# EasyEDA Pro project ProPrj_JS203-39-FIBER-3_2024-11-07.epro, schematic Schematic1

## Sheets
1 P1: Board Name: Board1; Create Date: 2024-11-05; Page Name: P1; Project Name: JS203-39-FIBER-3; Schematic Name: Schematic1; Update Date: 2024-11-05; Company: JOSN; Drawn: KevinLiao; Page Size: A4; Version: V0.1
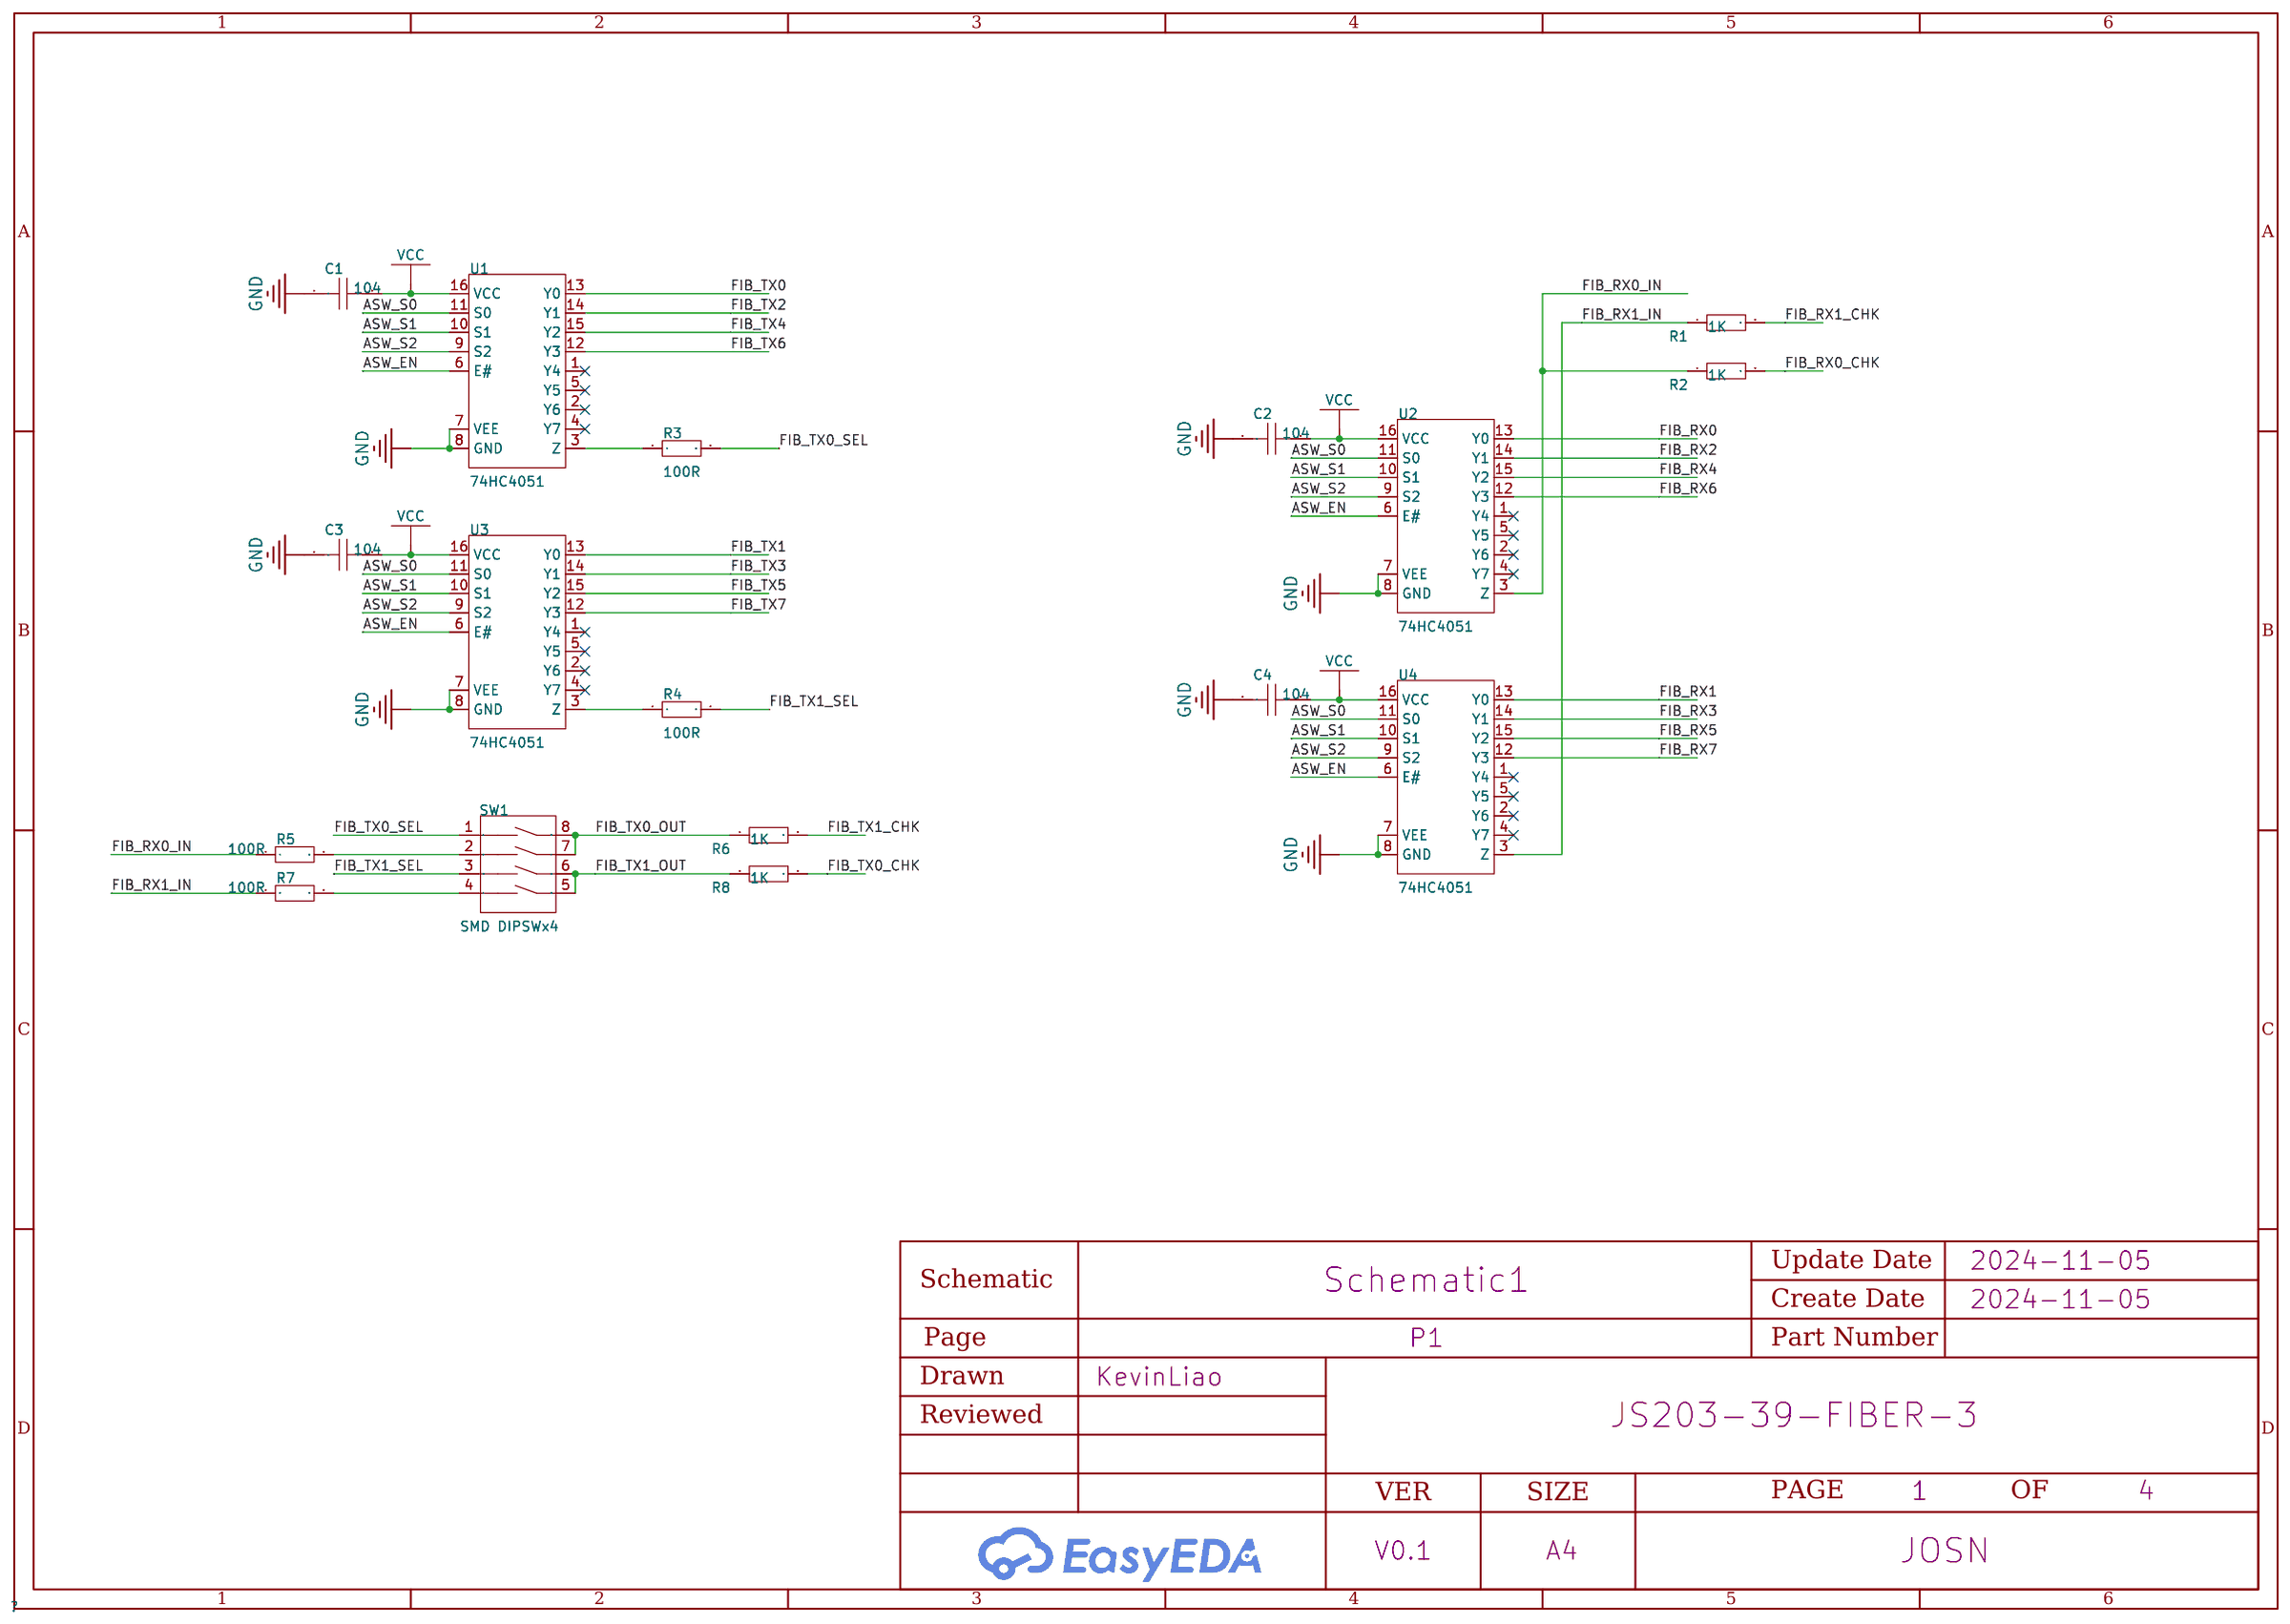
[diagram p0: P1]
2 P2: Page Name: P2
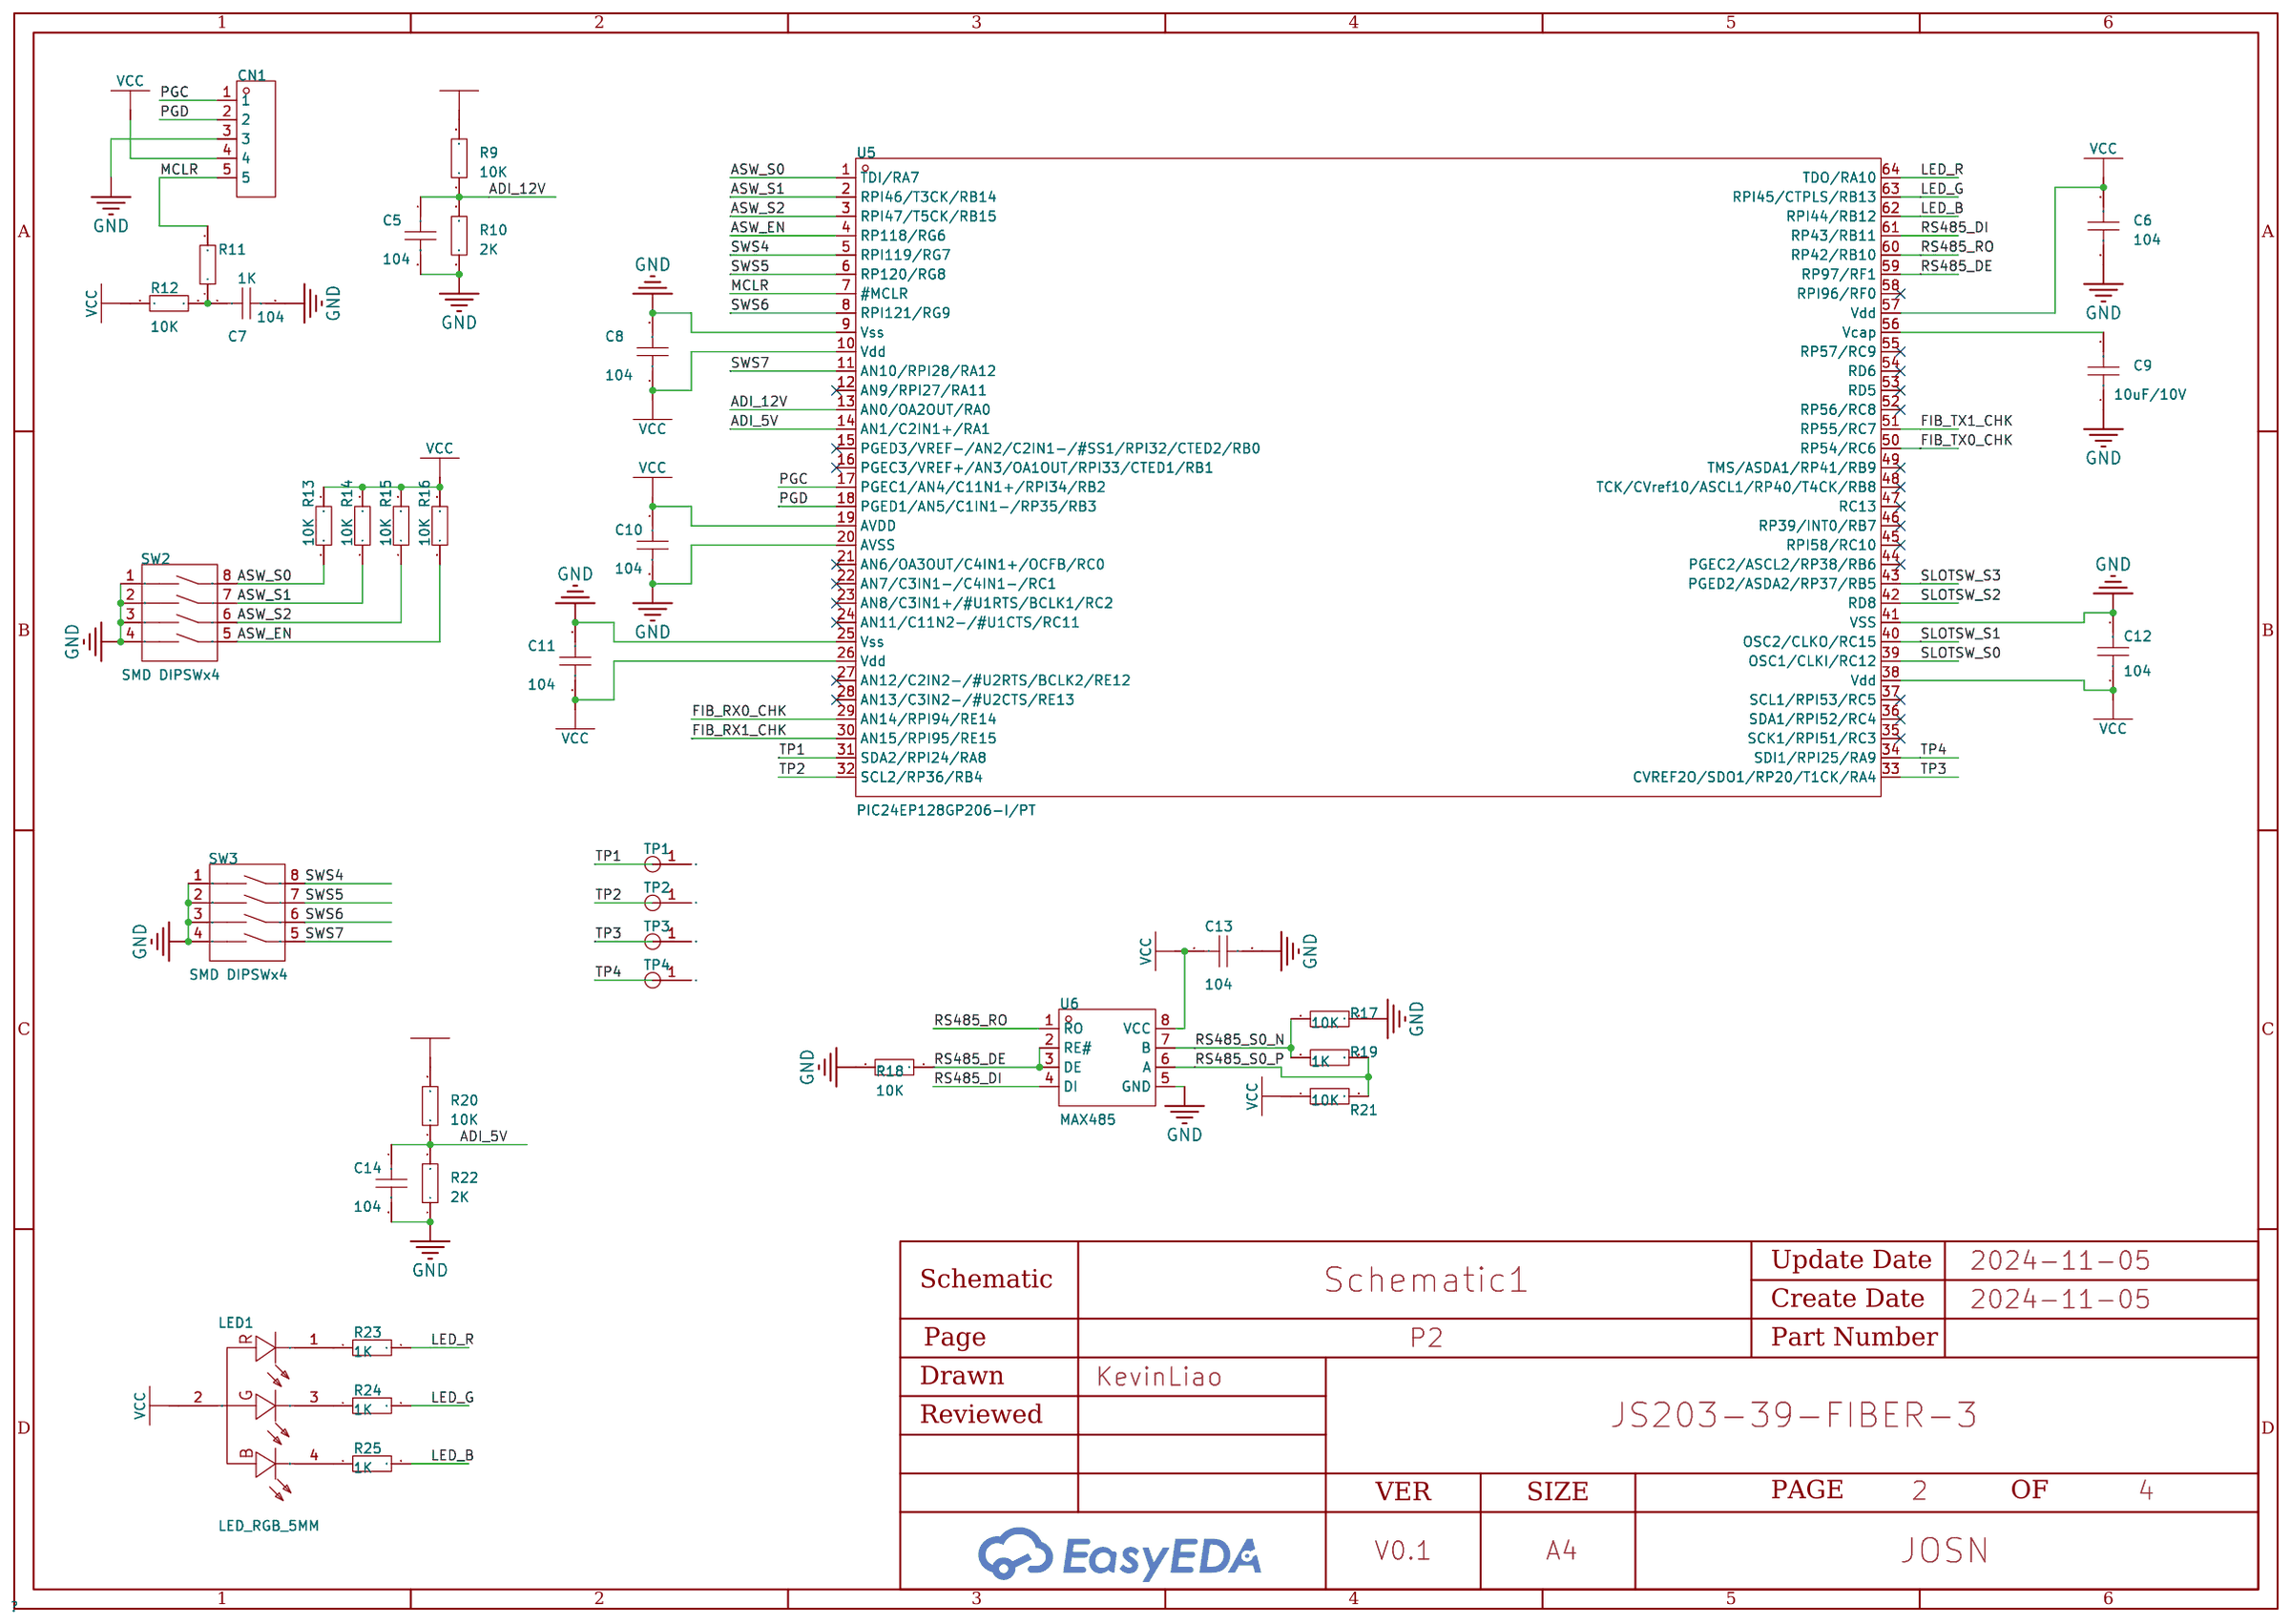
[diagram p1: P2]
3 P3: Page Name: P3; Page Size: A3
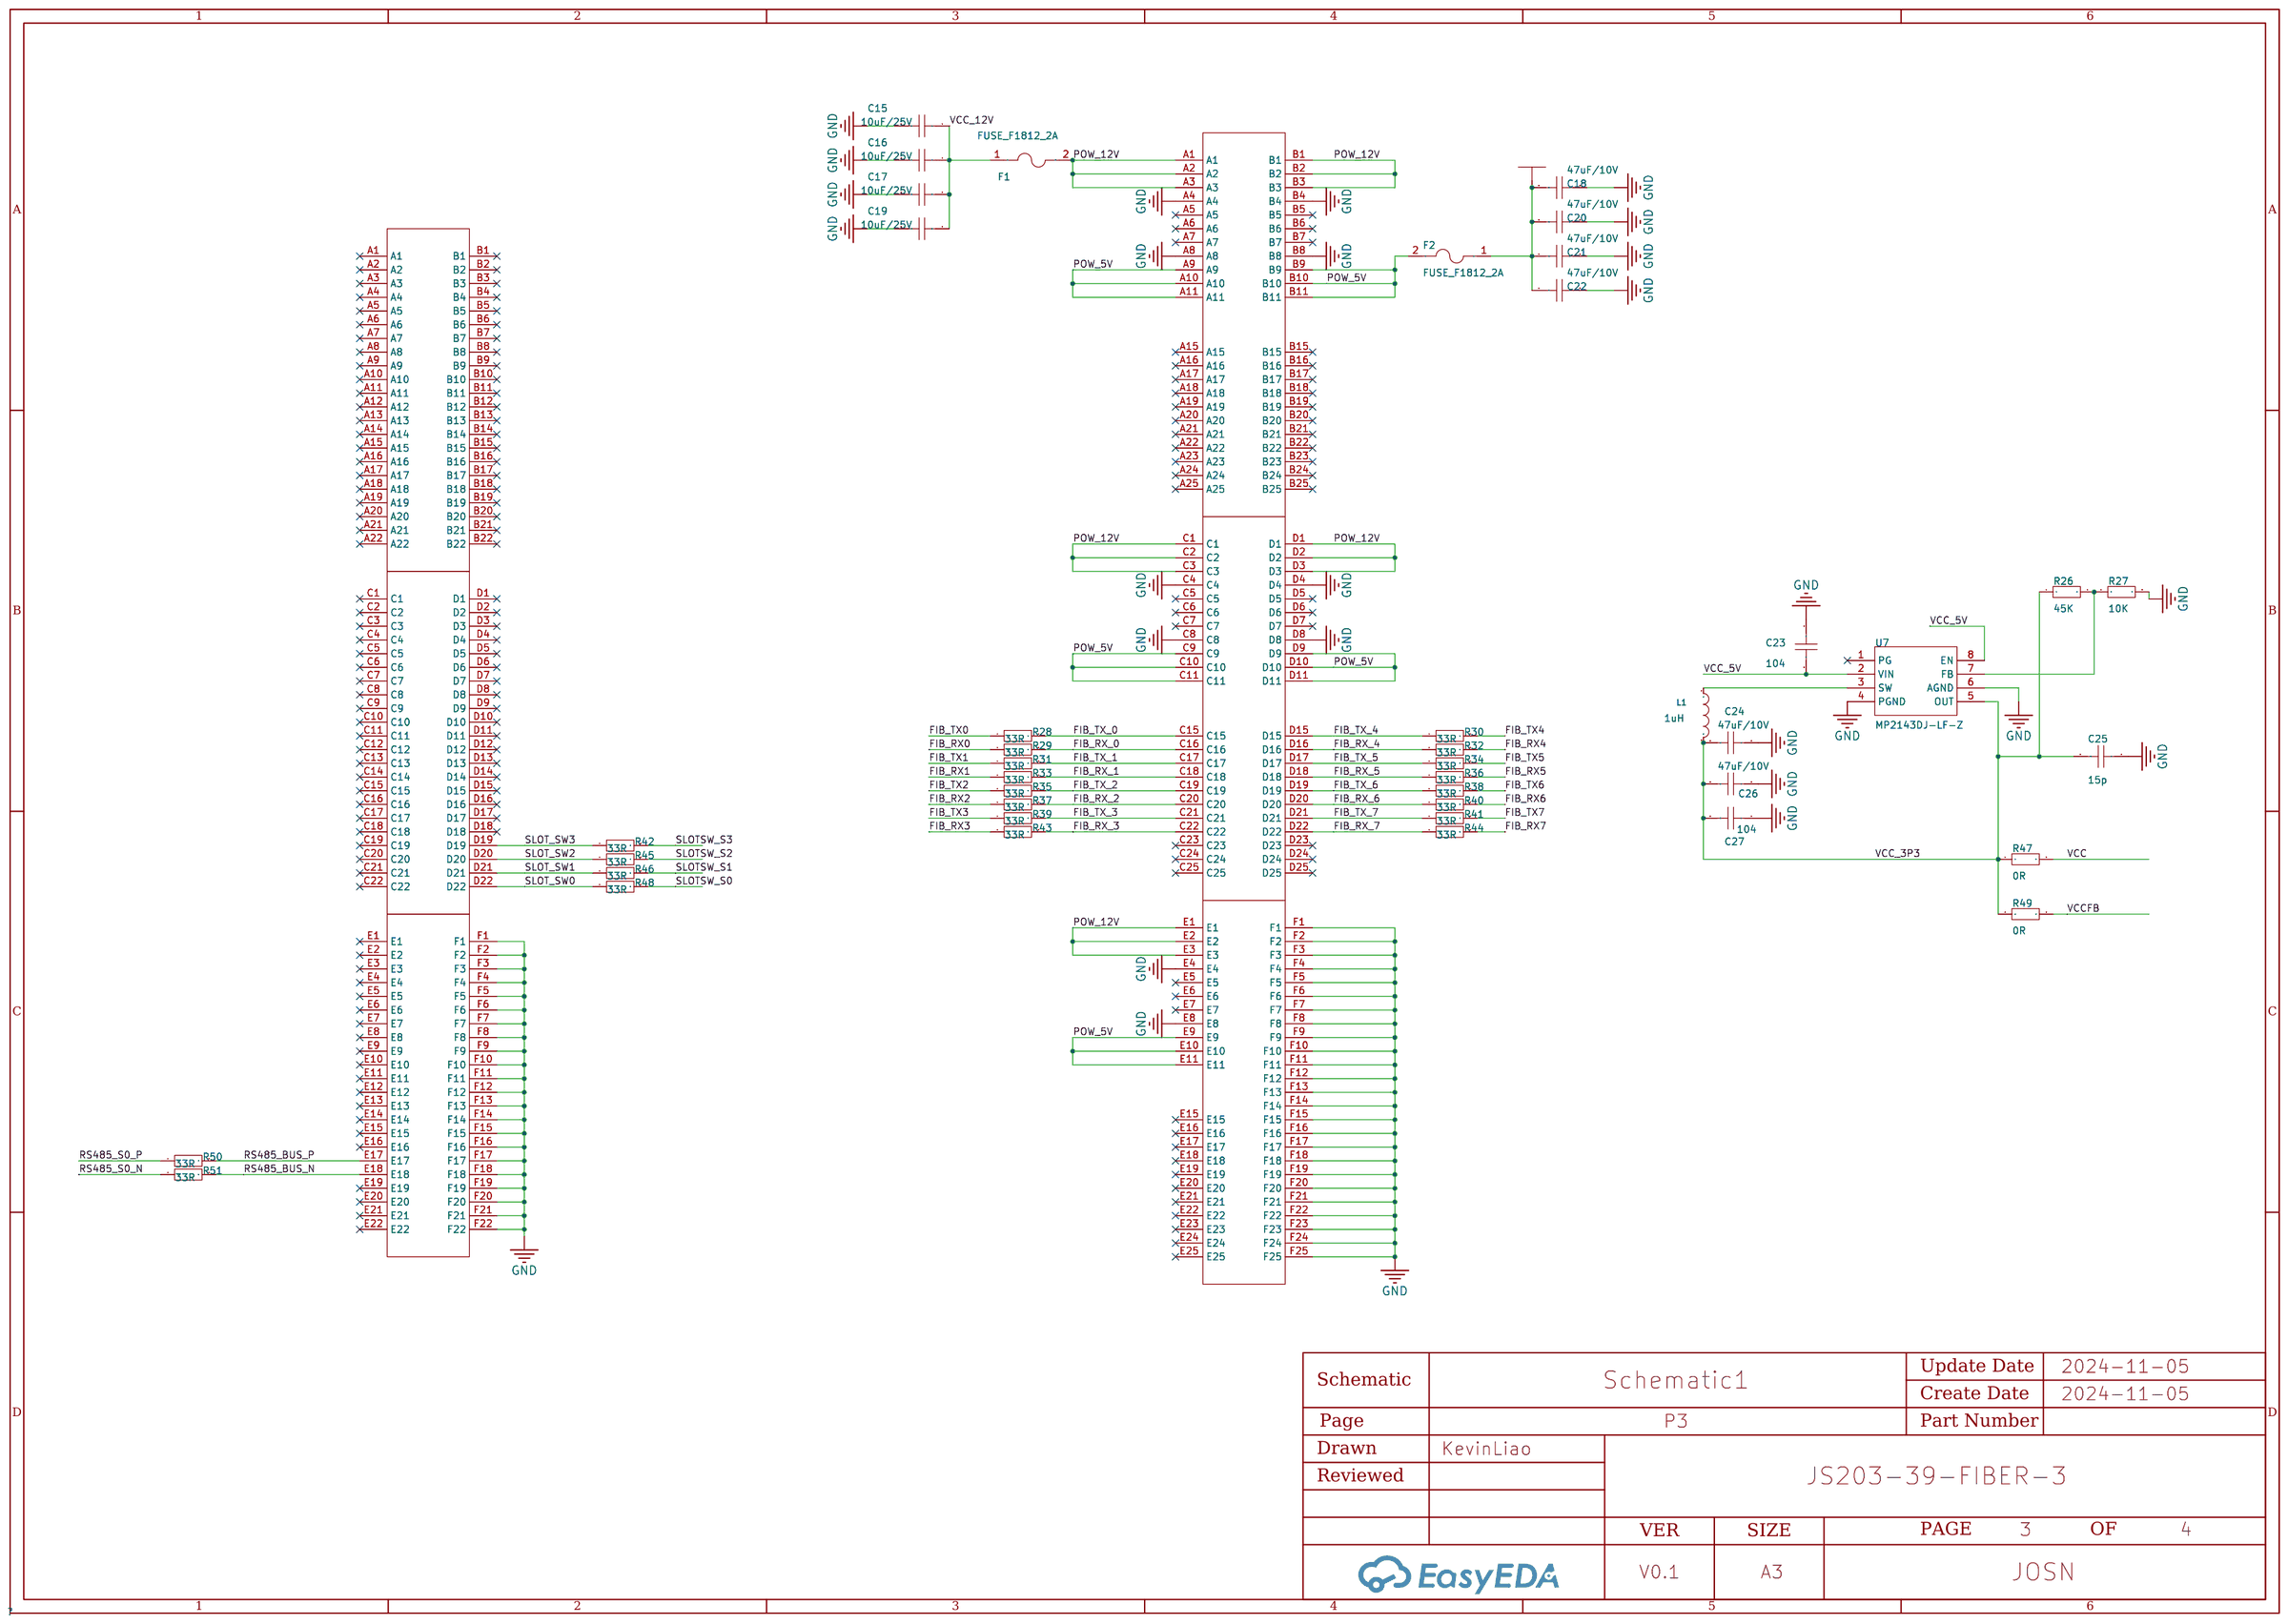
[diagram p2: P3]
4 P4: Page Name: P4; Company: EasyEDA.com; Drawn: EasyEDA; Part Number: JLCPCB-002; Reviewed: EasyEDA
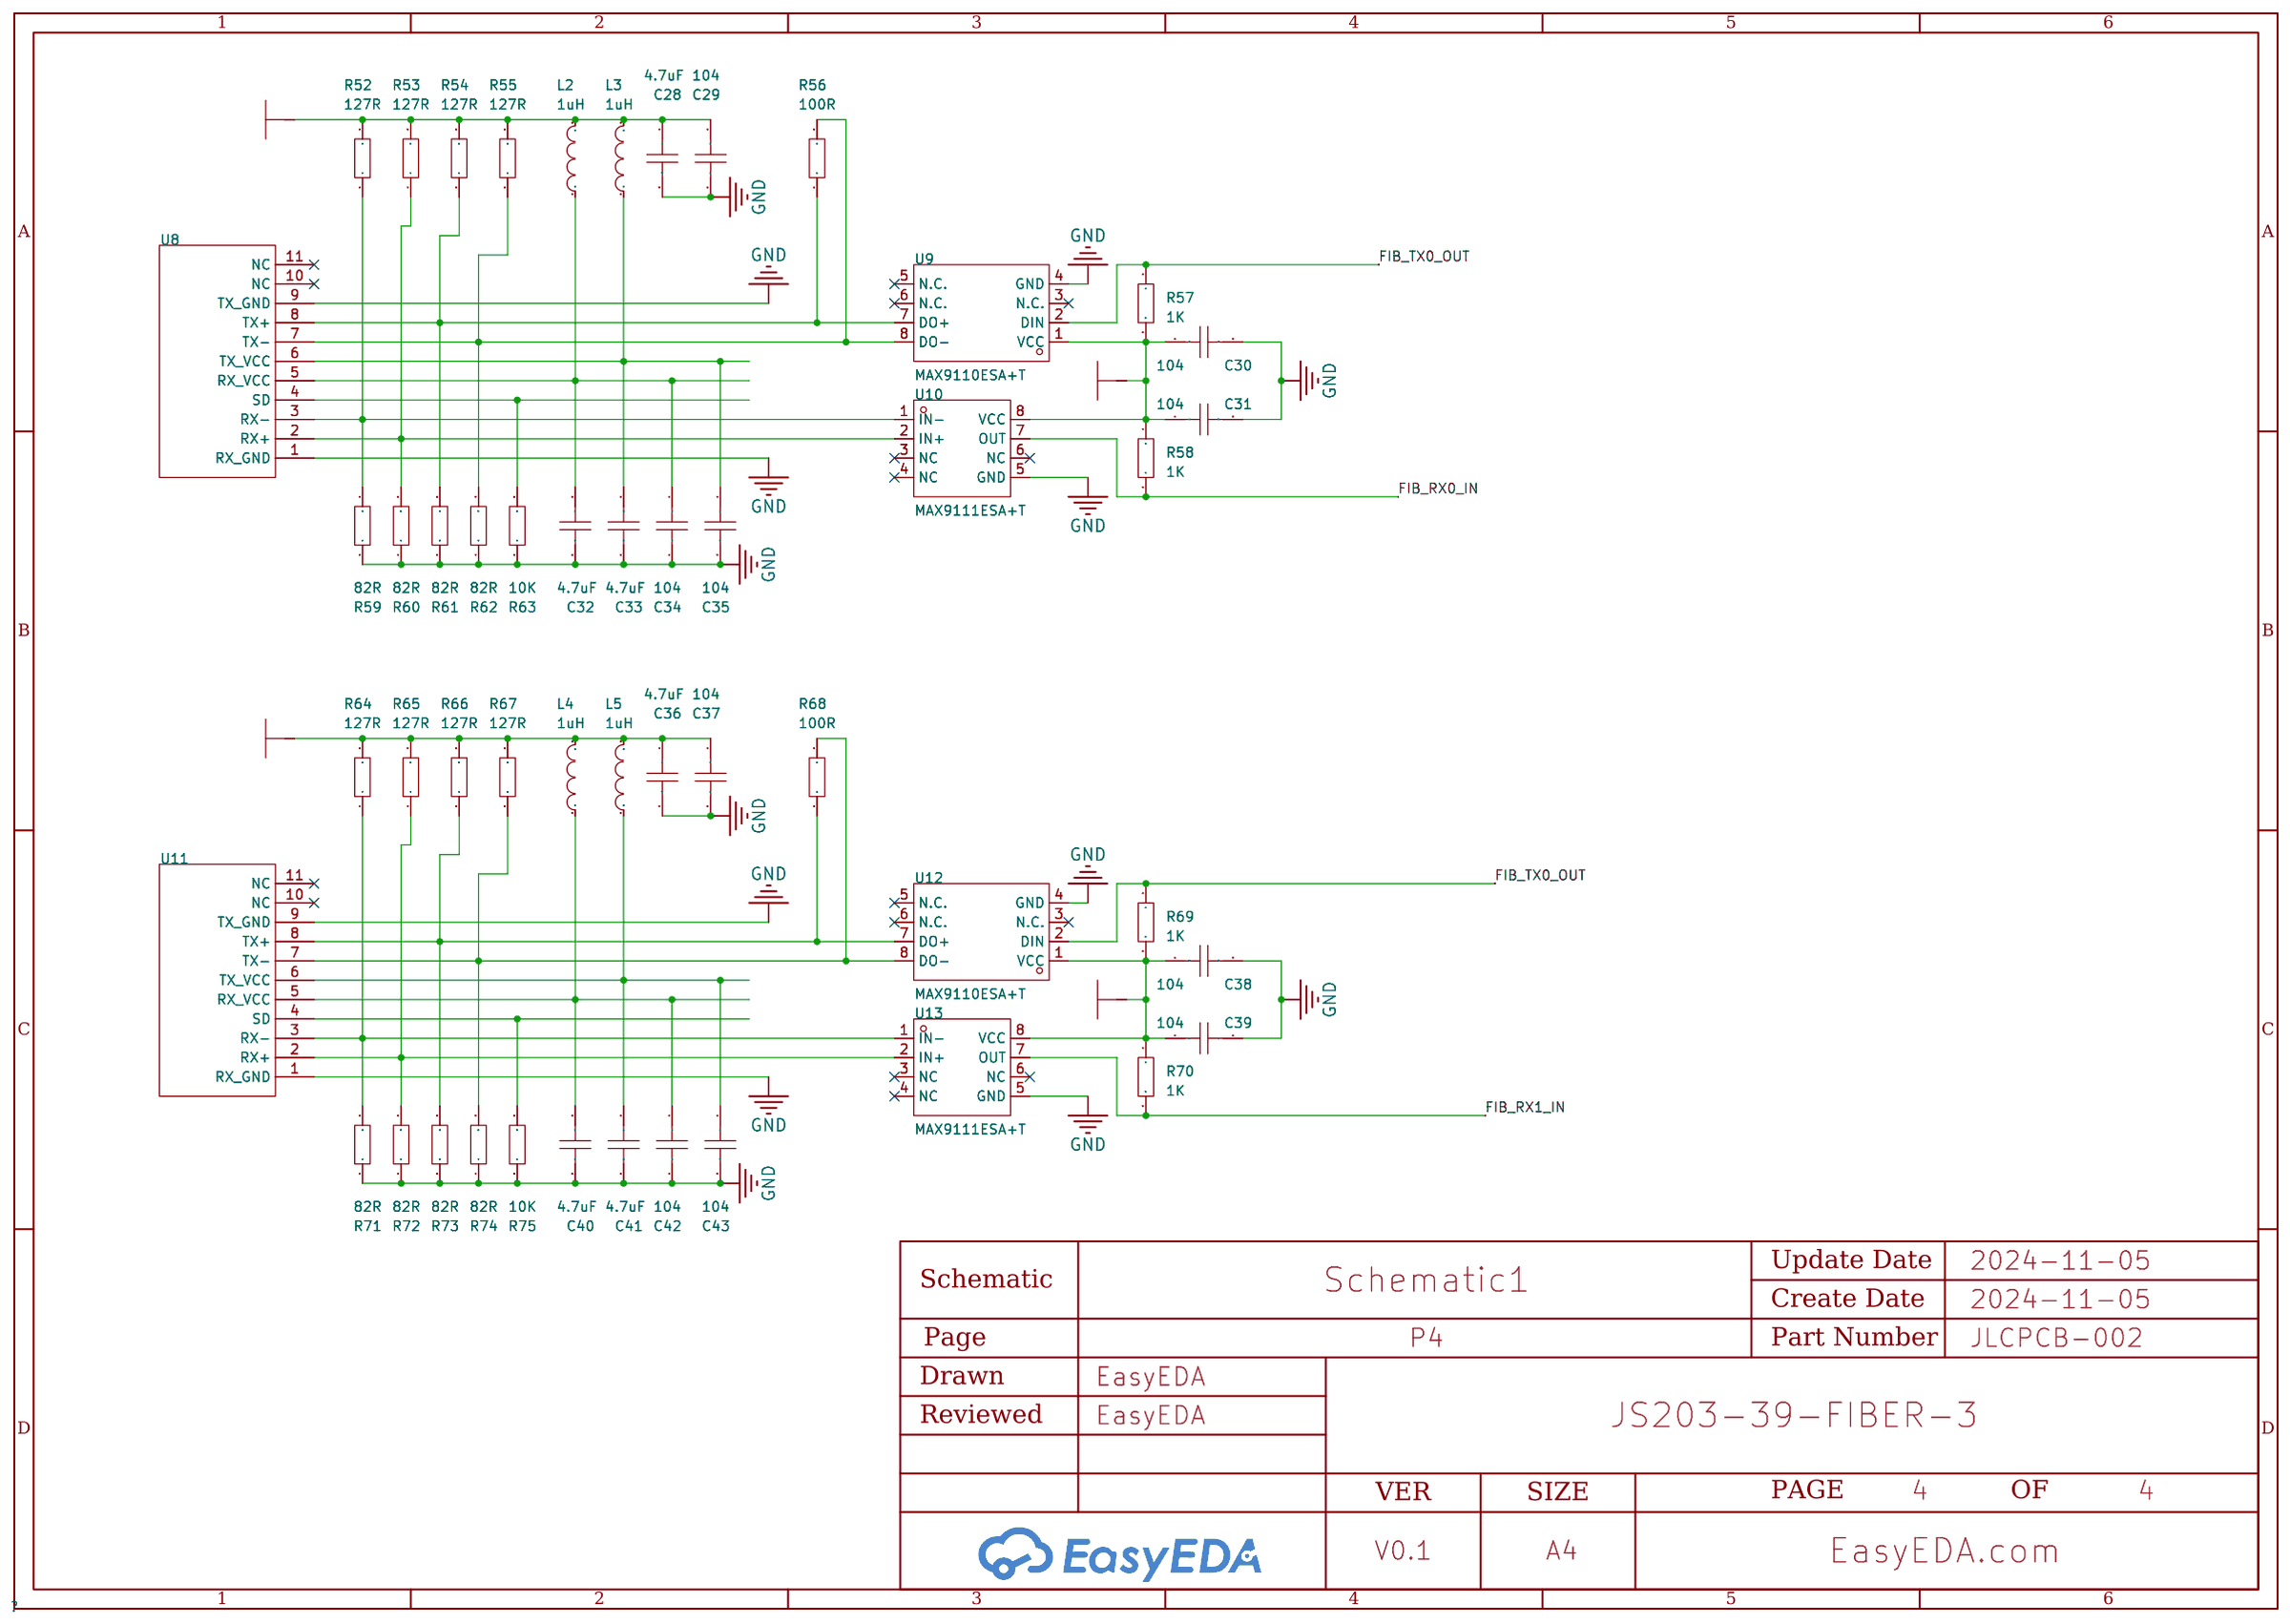
[diagram p3: P4]

## Parts
sheet P1
C1  104  [C0402]
C2  104  [C0402]
C3  104  [C0402]
C4  104  [C0402]
R1  1K  [R0402]
R2  1K  [R0402]
R3  100R  [R0402]
R4  100R  [R0402]
R5  100R  [R0402]
R6  1K  [R0402]
R7  100R  [R0402]
R8  1K  [R0402]
SW1  SMD DIPSWx4  [SW-SMD_8P-L6.7-W5.4-P1.27-LS8.4]
U1  74HC4051  [TSSOP-16_L5.0-W4.4-P0.65-LS6.4-BL-1]
U2  74HC4051  [TSSOP-16_L5.0-W4.4-P0.65-LS6.4-BL-1]
U3  74HC4051  [TSSOP-16_L5.0-W4.4-P0.65-LS6.4-BL-1]
U4  74HC4051  [TSSOP-16_L5.0-W4.4-P0.65-LS6.4-BL-1]
sheet P2
C5  104  [C0402]
C6  104  [C0402]
C7  104  [C0402]
C8  104  [C0402]
C9  10uF/10V  [C0805]
C10  104  [C0402]
C11  104  [C0402]
C12  104  [C0402]
C13  104  [C0402]
C14  104  [C0402]
CN1  5PIN-2.0MM-90  [CONN-TH_5P-P2.00-PH5A]
LED1  LED_RGB_5MM  [LED-TH_4P-BD5.8-P1.30]
R9  10K  [R0402]
R10  2K  [R0402]
R11  1K  [R0402]
R12  10K  [R0402]
R13  10K  [R0402]
R14  10K  [R0402]
R15  10K  [R0402]
R16  10K  [R0402]
R17  10K  [R0402]
R18  10K  [R0402]
R19  1K  [R0402]
R20  10K  [R0402]
R21  10K  [R0402]
R22  2K  [R0402]
R23  1K  [R0402]
R24  1K  [R0402]
R25  1K  [R0402]
SW2  SMD DIPSWx4  [SW-SMD_8P-L6.7-W5.4-P1.27-LS8.4]
SW3  SMD DIPSWx4  [SW-SMD_8P-L6.7-W5.4-P1.27-LS8.4]
TP1  -  [testPoint]
TP2  -  [testPoint]
TP3  -  [testPoint]
TP4  -  [testPoint]
U5  PIC24EP128GP206-I/PT  [TQFP-64_L10.0-W10.0-P0.50-LS12.0-BL]
U6  MAX485  [SOIC-8_L5.0-W4.0-P1.27-LS6.0-BL]
sheet P3
C15  10uF/25V  [C0805]
C16  10uF/25V  [C0805]
C17  10uF/25V  [C0805]
C18  47uF/10V  [C0805]
C19  10uF/25V  [C0805]
C20  47uF/10V  [C0805]
C21  47uF/10V  [C0805]
C22  47uF/10V  [C0805]
C23  104  [C0402]
C24  47uF/10V  [C0805]
C25  15p  [C0402]
C26  47uF/10V  [C0805]
C27  104  [C0402]
CON1  CPCI-CON-B  [cpci-con-b]
CON2  CPCI-CON-A  [cpci-con-a]
F1  FUSE_F1812_2A  [F1812]
F2  FUSE_F1812_2A  [F1812]
L1  1uH  [IND-SMD_L4.0-W4.0-A]
R26  45K  [R0402]
R27  10K  [R0402]
R28  33R  [R0402]
R29  33R  [R0402]
R30  33R  [R0402]
R31  33R  [R0402]
R32  33R  [R0402]
R33  33R  [R0402]
R34  33R  [R0402]
R35  33R  [R0402]
R36  33R  [R0402]
R37  33R  [R0402]
R38  33R  [R0402]
R39  33R  [R0402]
R40  33R  [R0402]
R41  33R  [R0402]
R42  33R  [R0402]
R43  33R  [R0402]
R44  33R  [R0402]
R45  33R  [R0402]
R46  33R  [R0402]
R47  0R  [R1210]
R48  33R  [R0402]
R49  0R  [R1210]
R50  33R  [R0402]
R51  33R  [R0402]
U7  MP2143DJ-LF-Z  [TSOT-23-8_L2.9-W1.6-P0.65-LS2.8-BR]
sheet P4
C28  4.7uF  [C0805]
C29  104  [C0402]
C30  104  [C0402]
C31  104  [C0402]
C32  4.7uF  [C0805]
C33  4.7uF  [C0805]
C34  104  [C0402]
C35  104  [C0402]
C36  4.7uF  [C0805]
C37  104  [C0402]
C38  104  [C0402]
C39  104  [C0402]
C40  4.7uF  [C0805]
C41  4.7uF  [C0805]
C42  104  [C0402]
C43  104  [C0402]
L2  1uH  [L0805]
L3  1uH  [L0805]
L4  1uH  [L0805]
L5  1uH  [L0805]
R52  127R  [R0402]
R53  127R  [R0402]
R54  127R  [R0402]
R55  127R  [R0402]
R56  100R  [R0402]
R57  1K  [R0402]
R58  1K  [R0402]
R59  82R  [R0402]
R60  82R  [R0402]
R61  82R  [R0402]
R62  82R  [R0402]
R63  10K  [R0402]
R64  127R  [R0402]
R65  127R  [R0402]
R66  127R  [R0402]
R67  127R  [R0402]
R68  100R  [R0402]
R69  1K  [R0402]
R70  1K  [R0402]
R71  82R  [R0402]
R72  82R  [R0402]
R73  82R  [R0402]
R74  82R  [R0402]
R75  10K  [R0402]
U8  -  [AFBR-5803TZ]
U9  MAX9110ESA+T  [SOIC-8_L4.9-W3.9-P1.27-LS6.0-BL]
U10  MAX9111ESA+T  [SOIC-8_L4.9-W3.9-P1.27-LS6.0-BL]
U11  -  [AFBR-5803TZ]
U12  MAX9110ESA+T  [SOIC-8_L4.9-W3.9-P1.27-LS6.0-BL]
U13  MAX9111ESA+T  [SOIC-8_L4.9-W3.9-P1.27-LS6.0-BL]

## Library data of the parts
C1-C8 C10-C14 C23 C25 C27 C29-C31 C34 C35 C37-C39 C42 C43 = CAP_0402: Supplier Part: C1525; Supplier Footprint: 0402
R1-R46 R48 R50-R75 = Res_0402: Supplier Footprint: 0402
SW1-SW3 = DSHP04TSGER: Supplier Part: C9900017355; JLCPCB Part Class: Extended Part; Supplier: LCSC
U1-U4 = MM74HC4051MTCX: Number of Channels:1 Supply Voltage:2V~6V Supply Voltage:2V~6V Turn-on time:41ns On-State Resistance (Max):100Ω Turn-off time:32ns; Supplier Part: C3658060; Manufacturer: onsemi(安森美); Supplier Footprint: TSSOP-16; JLCPCB Part Class: 扩展库; Datasheet: https://atta.szlcsc.com/upload/public/pdf/source/20230915/824FCEC5876B234B30D1A8426A82F47F.pdf; Supplier: LCSC; Number of Channels: 1; Supply Voltage: 2V~6V; Turn-on time: 41ns; On-State Resistance (Max): 100Ω; Turn-off time: 32ns
C9 C15-C22 C24 C26 C28 C32 C33 C36 C40 C41 = CAP_0805: Supplier Footprint: 0805
CN1 = 5PIN-2.0MM-90: Supplier Part: C9900021156; Supplier Footprint: CONN-TH-5P; JLCPCB Part Class: Extended Part; Datasheet: https://atta.szlcsc.comnull; Supplier: LCSC
LED1 = 三色灯2: Supplier Part: C9900021929; Supplier Footprint: LED-TH-4P; JLCPCB Part Class: Extended Part; Supplier: LCSC
TP1-TP4 = testPoint
U5 = PIC24EP128GP206-I/PT: CPU Core:PIC Program Storage Size:128KB GPIO Ports Number:53 Operating Voltage Range:3V~3.6V Operating Voltage Range:3V~3.6V CPU Maximum Speed:280MHz Program Memory Type:FLASH Operating Temperature Range:-40℃~+85℃ Operating Temperature Range:-40℃~+85℃ ADC; Supplier Part: C634687; Manufacturer: MICROCHIP(美国微芯); Supplier Footprint: TQFP-64(10x10); JLCPCB Part Class: 扩展库; Datasheet: https://atta.szlcsc.com/upload/public/pdf/source/20211010/C2832038_8BF8787F22686B658698B1EF3F45BF2F.pdf; Supplier: LCSC; CPU Core: PIC; Program Storage Size: 128KB; GPIO Ports Number: 53; Operating Voltage Range: 3V~3.6V; CPU Maximum Speed: 280MHz; Program Memory Type: FLASH; Operating Temperature Range: -40℃~+85℃; ADC (Bit): 10bit；12bit; Peripheral/Function: PWM；PWM; Watchdog: 有; Infrared Data Association: 有; Low-Voltage Detect: 有; Direct Memory Access: 有; Internal Oscillator: 有
U6 = MAX485ESA-MS: Types:transceiver Supply Voltage:4.75V~5.25V Supply Voltage:4.75V~5.25V Data Rate:2.5Mbps Data Rate:2.5Mbps Driver/receiver:1/1 Node Number:32 ESD Protect:±15kV ESD Protect:±15kV Whether the isolation:- Operating Temperature:-40℃~+85℃ Operating Temperatur; Supplier Part: C7434432; Manufacturer: MSKSEMI(美森科); Supplier Footprint: SOP-8; Datasheet: https://atta.szlcsc.com/upload/public/pdf/source/20230628/9E874313D8358D77451CB60EFEDE67C0.pdf; Supplier: LCSC; Types: transceiver; Supply Voltage: 4.75V~5.25V; Data Rate: 2.5Mbps; Driver/receiver: 1/1; Node Number: 32; ESD Protect: ±15kV; Operating Temperature: -40℃~+85℃
CON1 = pci-con-b
CON2 = cpci-con-a
F1 F2 = FUSE_F1812_FUSE: Supplier Part: C9900007509; JLCPCB Part Class: Extended Part; Datasheet: https://atta.szlcsc.comnull; Supplier: LCSC
L1 = XFL4020-152MEC: Inductance: Tolerance:±20% Tolerance:±20% Rated Current:- Saturation Current (Isat):- DC Resistance (DCR):- Type:- Ratings:-; LCSC Part Name: 1.5uH ±20%; Supplier Part: C3033018; Manufacturer: Coilcraft(线艺); Supplier Footprint: SMD,4x4mm; JLCPCB Part Class: Extended Part; Datasheet: https://atta.szlcsc.com/upload/public/pdf/source/20220606/2F3F6B3731D30DFC0E7308BCF15AD72A.pdf; Supplier: LCSC; Tolerance: ±20%
R47 R49 = Res_1210: Supplier Footprint: 1210
U7 = MP2143DJ-LF-Z: Function:Step-down type Output Type:Adjustable Input Voltage:2.5V~5.5V Input Voltage:2.5V~5.5V Output Voltage:0.6V~5V Output Voltage:0.6V~5V Output Current (Max):3A Switching Frequency:1.2MHz Operating Temperature:-40℃~+125℃@(TJ) Operating Temperature:-40; Supplier Part: C43427; Supplier Footprint: TSOT-23-8; JLCPCB Part Class: 扩展库; Supplier: LCSC; Function: Step-down type; Output Type: Adjustable; Input Voltage: 2.5V~5.5V; Output Voltage: 0.6V~5V; Output Current (Max): 3A; Switching Frequency: 1.2MHz; Operating Temperature: -40℃~+125℃@(TJ); Synchronous Rectification: Yes; Number of Outputs: 1; Topology: Step-down; Switch tube (built-in/external): 内置
L2-L5 = L_0805
U8 U11 = AFBR-5803TZ
U9 U12 = MAX9110ESA+T: Type: Protocol: Numberof Drivers:1 Numberof Receivers:0 Supply Voltage:3.3V Supply Voltage:3.3V Data Rate:; Supplier Part: C3235036; Manufacturer: ADI(亚德诺)/MAXIM(美信); Supplier Footprint: SOIC-8; JLCPCB Part Class: 扩展库; Datasheet: https://atta.szlcsc.com/upload/public/pdf/source/20221101/9681F230F46C99E53DA27F614A9C7A00.pdf; Supplier: LCSC; Numberof Drivers: 1; Numberof Receivers: 0; Supply Voltage: 3.3V
U10 U13 = MAX9111ESA+T: Type:Receivers Protocol: Numberof Drivers:0 Numberof Receivers:1 Supply Voltage:3V~3.6V Supply Voltage:3V~3.6V Data Rate:; Supplier Part: C2672252; Manufacturer: ADI(亚德诺)/MAXIM(美信); Supplier Footprint: SOIC-8; JLCPCB Part Class: 扩展库; Datasheet: https://atta.szlcsc.com/upload/public/pdf/source/20210603/E06AC82415230B9EDCD0D7C660C507AE.pdf; Supplier: LCSC; Type: Receivers; Numberof Drivers: 0; Numberof Receivers: 1; Supply Voltage: 3V~3.6V

## Nets
GND: C1.1 C2.1 C3.1 C4.1 C5.2 C6.2 C7.2 C8.2 C9.1 C10.2 C11.2 C12.2 C13.2 C14.2 C15.2 C16.2 C17.2 C18.2 C19.2 C20.2 C21.2 C22.2 C23.1 C24.1 C25.1 C26.1 C27.1 C28.2 C29.2 C30.2 C31.2 C32.2 C33.2 C34.2 C35.2 C36.2 C37.2 C38.2 C39.2 C40.2 C41.2 C42.2 C43.2 CN1.3 CON1.A4 CON1.A8 CON1.B4 CON1.B8 CON1.C4 CON1.C8 CON1.D4 CON1.D8 CON1.E4 CON1.E8 CON1.F1 CON1.F2 CON1.F3 CON1.F4 CON1.F5 CON1.F6 CON1.F7 CON1.F8 CON1.F9 CON1.F10 CON1.F11 CON1.F12 CON1.F13 CON1.F14 CON1.F15 CON1.F16 CON1.F17 CON1.F18 CON1.F19 CON1.F20 CON1.F21 CON1.F22 CON1.F23 CON1.F24 CON1.F25 CON2.F1 CON2.F2 CON2.F3 CON2.F4 CON2.F5 CON2.F6 CON2.F7 CON2.F8 CON2.F9 CON2.F10 CON2.F11 CON2.F12 CON2.F13 CON2.F14 CON2.F15 CON2.F16 CON2.F17 CON2.F18 CON2.F19 CON2.F20 CON2.F21 CON2.F22 R10.1 R17.2 R18.2 R22.1 R27.2 R59.1 R60.1 R61.1 R62.1 R63.1 R71.1 R72.1 R73.1 R74.1 R75.1 SW2.1 SW2.2 SW2.3 SW2.4 SW3.1 SW3.2 SW3.3 SW3.4 U1.7(VEE) U1.8(GND) U2.7(VEE) U2.8(GND) U3.7(VEE) U3.8(GND) U4.7(VEE) U4.8(GND) U5.9(Vss) U5.20(AVSS) U5.25(Vss) U5.41(VSS) U6.5(GND) U7.4(PGND) U7.6(AGND) U8.1(RX_GND) U8.9(TX_GND) U9.4(GND) U10.5(GND) U11.1(RX_GND) U11.9(TX_GND) U12.4(GND) U13.5(GND)
VCC: C1.2 C2.2 C3.2 C4.2 C6.1 C8.1 C10.1 C11.1 C12.1 C13.1 CN1.4 LED1.2(CA) R12.1 R13.2 R14.2 R15.2 R16.2 R21.1 R47.2 U1.16(VCC) U2.16(VCC) U3.16(VCC) U4.16(VCC) U5.10(Vdd) U5.19(AVDD) U5.26(Vdd) U5.38(Vdd) U5.57(Vdd) U6.8(VCC)
VCC_3P3: C24.2 C25.2 C26.2 C27.2 L1.2 R26.1 R47.1 R49.1 U7.5(OUT)
VCC_5V: C18.1 C20.1 C21.1 C22.1 C23.2 F2.1 R20.2 U7.2(VIN) U7.8(EN)
VCC_12V: C15.1 C16.1 C17.1 C19.1 F1.1 R9.2
VCCFB: C28.1 C29.1 C30.1 C31.1 C36.1 C37.1 C38.1 C39.1 L2.2 L3.2 L4.2 L5.2 R49.2 R52.2 R53.2 R54.2 R55.2 R57.2 R58.1 R64.2 R65.2 R66.2 R67.2 R69.2 R70.1 U9.1(VCC) U10.8(VCC) U12.1(VCC) U13.8(VCC)
ADI_5V: C14.1 R20.1 R22.2 U5.14(AN1/C2IN1+/RA1)
ADI_12V: C5.1 R9.1 R10.2 U5.13(AN0/OA2OUT/RA0)
ASW_EN: R16.1 SW2.5 U1.6(E#) U2.6(E#) U3.6(E#) U4.6(E#) U5.4(RP118/RG6)
ASW_S0: R13.1 SW2.8 U1.11(S0) U2.11(S0) U3.11(S0) U4.11(S0) U5.1(TDI/RA7)
ASW_S1: R14.1 SW2.7 U1.10(S1) U2.10(S1) U3.10(S1) U4.10(S1) U5.2(RPI46/T3CK/RB14)
ASW_S2: R15.1 SW2.6 U1.9(S2) U2.9(S2) U3.9(S2) U4.9(S2) U5.3(RPI47/T5CK/RB15)
FIB_RX0: R29.1 U2.13(Y0)
FIB_RX0_CHK: R2.2 U5.29(AN14/RPI94/RE14)
FIB_RX0_IN: R2.1 R5.1 R58.2 U2.3(Z) U10.7(OUT)
FIB_RX1: R33.1 U4.13(Y0)
FIB_RX1_CHK: R1.2 U5.30(AN15/RPI95/RE15)
FIB_RX1_IN: R1.1 R7.1 R70.2 U4.3(Z) U13.7(OUT)
FIB_RX2: R37.1 U2.14(Y1)
FIB_RX3: R43.1 U4.14(Y1)
FIB_RX4: R32.2 U2.15(Y2)
FIB_RX5: R36.2 U4.15(Y2)
FIB_RX6: R40.2 U2.12(Y3)
FIB_RX7: R44.2 U4.12(Y3)
FIB_RX_0: CON1.C16 R29.2
FIB_RX_1: CON1.C18 R33.2
FIB_RX_2: CON1.C20 R37.2
FIB_RX_3: CON1.C22 R43.2
FIB_RX_4: CON1.D16 R32.1
FIB_RX_5: CON1.D18 R36.1
FIB_RX_6: CON1.D20 R40.1
FIB_RX_7: CON1.D22 R44.1
FIB_TX0: R28.1 U1.13(Y0)
FIB_TX0_CHK: R8.2 U5.50(RP54/RC6)
FIB_TX0_OUT: R6.1 R57.1 R69.1 SW1.7 SW1.8 U9.2(DIN) U12.2(DIN)
FIB_TX0_SEL: R3.2 SW1.1
FIB_TX1: R31.1 U3.13(Y0)
FIB_TX1_CHK: R6.2 U5.51(RP55/RC7)
FIB_TX1_OUT: R8.1 SW1.5 SW1.6
FIB_TX1_SEL: R4.2 SW1.3
FIB_TX2: R35.1 U1.14(Y1)
FIB_TX3: R39.1 U3.14(Y1)
FIB_TX4: R30.2 U1.15(Y2)
FIB_TX5: R34.2 U3.15(Y2)
FIB_TX6: R38.2 U1.12(Y3)
FIB_TX7: R41.2 U3.12(Y3)
FIB_TX_0: CON1.C15 R28.2
FIB_TX_1: CON1.C17 R31.2
FIB_TX_2: CON1.C19 R35.2
FIB_TX_3: CON1.C21 R39.2
FIB_TX_4: CON1.D15 R30.1
FIB_TX_5: CON1.D17 R34.1
FIB_TX_6: CON1.D19 R38.1
FIB_TX_7: CON1.D21 R41.1
LED_B: R25.2 U5.62(RPI44/RB12)
LED_G: R24.2 U5.63(RPI45/CTPLS/RB13)
LED_R: R23.2 U5.64(TDO/RA10)
MCLR: CN1.5 R11.2 U5.7(#MCLR)
PGC: CN1.1 U5.17(PGEC1/AN4/C11N1+/RPI34/RB2)
PGD: CN1.2 U5.18(PGED1/AN5/C1IN1-/RP35/RB3)
POW_5V: CON1.A9 CON1.A10 CON1.A11 CON1.B9 CON1.B10 CON1.B11 CON1.C9 CON1.C10 CON1.C11 CON1.D9 CON1.D10 CON1.D11 CON1.E9 CON1.E10 CON1.E11 F2.2
POW_12V: CON1.A1 CON1.A2 CON1.A3 CON1.B1 CON1.B2 CON1.B3 CON1.C1 CON1.C2 CON1.C3 CON1.D1 CON1.D2 CON1.D3 CON1.E1 CON1.E2 CON1.E3 F1.2
RS485_BUS_N: CON2.E18 R51.2
RS485_BUS_P: CON2.E17 R50.2
RS485_DE: R18.1 U5.59(RP97/RF1) U6.2(RE#) U6.3(DE)
RS485_DI: U5.61(RP43/RB11) U6.4(DI)
RS485_RO: U5.60(RP42/RB10) U6.1(RO)
RS485_S0_N: R17.1 R19.1 R51.1 U6.7(B)
RS485_S0_P: R19.2 R21.2 R50.1 U6.6(A)
SLOT_SW0: CON2.D22 R48.1
SLOT_SW1: CON2.D21 R46.1
SLOT_SW2: CON2.D20 R45.1
SLOT_SW3: CON2.D19 R42.1
SLOTSW_S0: R48.2 U5.39(OSC1/CLKI/RC12)
SLOTSW_S1: R46.2 U5.40(OSC2/CLKO/RC15)
SLOTSW_S2: R45.2 U5.42(RD8)
SLOTSW_S3: R42.2 U5.43(PGED2/ASDA2/RP37/RB5)
SWS4: SW3.8 U5.5(RPI119/RG7)
SWS5: SW3.7 U5.6(RP120/RG8)
SWS6: SW3.6 U5.8(RPI121/RG9)
SWS7: SW3.5 U5.11(AN10/RPI28/RA12)
TP1: TP1.1 U5.31(SDA2/RPI24/RA8)
TP2: TP2.1 U5.32(SCL2/RP36/RB4)
TP3: TP3.1 U5.33(CVREF2O/SDO1/RP20/T1CK/RA4)
TP4: TP4.1 U5.34(SDI1/RPI25/RA9)
$1N8234: R3.1 U1.3(Z)
$1N8273: R4.1 U3.3(Z)
$1N8683: R5.2 SW1.2
$1N8687: R7.2 SW1.4
$2N4157: LED1.1(KR) R23.1
$2N4158: LED1.3(KG) R24.1
$2N4159: LED1.4(KB) R25.1
$2N4826: C9.2 U5.56(Vcap)
$2N7069: C7.1 R11.1 R12.2
$3N8331: L1.1 U7.3(SW)
$3N10229: R26.2 R27.1 U7.7(FB)
$4N1825: R54.1 R56.1 R61.2 U8.8(TX+) U9.7(DO+)
$4N1834: R55.1 R56.2 R62.2 U8.7(TX-) U9.8(DO-)
$4N1844: C33.1 C35.1 L3.1 U8.6(TX_VCC)
$4N1851: C32.1 C34.1 L2.1 U8.5(RX_VCC)
$4N1858: R63.2 U8.4(SD)
$4N1862: R52.1 R59.2 U8.3(RX-) U10.1(IN-)
$4N1867: R53.1 R60.2 U8.2(RX+) U10.2(IN+)
$4N1936: R66.1 R68.1 R73.2 U11.8(TX+) U12.7(DO+)
$4N1945: R67.1 R68.2 R74.2 U11.7(TX-) U12.8(DO-)
$4N1955: C41.1 C43.1 L5.1 U11.6(TX_VCC)
$4N1962: C40.1 C42.1 L4.1 U11.5(RX_VCC)
$4N1969: R75.2 U11.4(SD)
$4N1973: R64.1 R71.2 U11.3(RX-) U13.1(IN-)
$4N1978: R65.1 R72.2 U11.2(RX+) U13.2(IN+)

Not connected (* = marked no-connect by the designer): CON1 A5* A6* A7* A15* A16* A17* A18* A19* A20* A21* A22* A23* A24* A25* B5* B6* B7* B15* B16* B17* B18* B19* B20* B21* B22* B23* B24* B25* C5* C6* C7* C23* C24* C25* D5* D6* D7* D23* D24* D25* E5* E6* E7* E15* E16* E17* E18* E19* E20* E21* E22* E23* E24* E25*; CON2 A1* A2* A3* A4* A5* A6* A7* A8* A9* A10* A11* A12* A13* A14* A15* A16* A17* A18* A19* A20* A21* A22* B1* B2* B3* B4* B5* B6* B7* B8* B9* B10* B11* B12* B13* B14* B15* B16* B17* B18* B19* B20* B21* B22* C1* C2* C3* C4* C5* C6* C7* C8* C9* C10* C11* C12* C13* C14* C15* C16* C17* C18* C19* C20* C21* C22* D1* D2* D3* D4* D5* D6* D7* D8* D9* D10* D11* D12* D13* D14* D15* D16* D17* D18* E1* E2* E3* E4* E5* E6* E7* E8* E9* E10* E11* E12* E13* E14* E15* E16* E19* E20* E21* E22*; U1 1(Y4)* 2(Y6)* 4(Y7)* 5(Y5)*; U2 1(Y4)* 2(Y6)* 4(Y7)* 5(Y5)*; U3 1(Y4)* 2(Y6)* 4(Y7)* 5(Y5)*; U4 1(Y4)* 2(Y6)* 4(Y7)* 5(Y5)*; U5 12(AN9/RPI27/RA11)* 15(PGED3/VREF-/AN2/C2IN1-/#SS1/RPI32/CTED2/RB0)* 16(PGEC3/VREF+/AN3/OA1OUT/RPI33/CTED1/RB1)* 21(AN6/OA3OUT/C4IN1+/OCFB/RC0)* 22(AN7/C3IN1-/C4IN1-/RC1)* 23(AN8/C3IN1+/#U1RTS/BCLK1/RC2)* 24(AN11/C11N2-/#U1CTS/RC11)* 27(AN12/C2IN2-/#U2RTS/BCLK2/RE12)* 28(AN13/C3IN2-/#U2CTS/RE13)* 35(SCK1/RPI51/RC3)* 36(SDA1/RPI52/RC4)* 37(SCL1/RPI53/RC5)* 44(PGEC2/ASCL2/RP38/RB6)* 45(RPI58/RC10)* 46(RP39/INT0/RB7)* 47(RC13)* 48(TCK/CVref10/ASCL1/RP40/T4CK/RB8)* 49(TMS/ASDA1/RP41/RB9)* 52(RP56/RC8)* 53(RD5)* 54(RD6)* 55(RP57/RC9)* 58(RPI96/RF0)*; U7 1(PG)*; U8 10(NC)* 11(NC)*; U9 3(N.C.)* 5(N.C.)* 6(N.C.)*; U10 3(NC)* 4(NC)* 6(NC)*; U11 10(NC)* 11(NC)*; U12 3(N.C.)* 5(N.C.)* 6(N.C.)*; U13 3(NC)* 4(NC)* 6(NC)*
